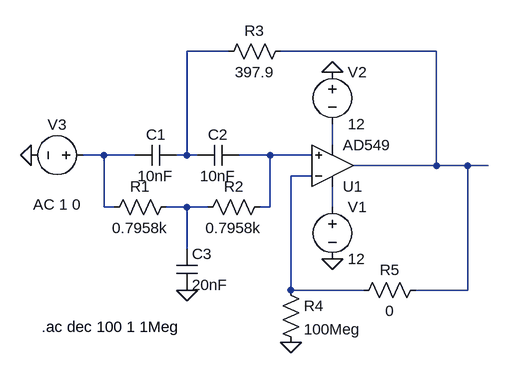
[diagram p0: schematic task5.asc]
task5.asc, the LTspice schematic file:
Version 4.1
SHEET 1 880 680
WIRE 64 0 0 0
WIRE 384 0 144 0
WIRE 224 144 224 112
WIRE -128 160 -160 160
WIRE -80 160 -128 160
WIRE 0 160 0 0
WIRE 0 160 -16 160
WIRE 16 160 0 160
WIRE 128 160 80 160
WIRE 192 160 128 160
WIRE 384 176 384 0
WIRE 384 176 256 176
WIRE 432 176 384 176
WIRE 464 176 432 176
WIRE 192 192 160 192
WIRE -128 240 -128 160
WIRE -112 240 -128 240
WIRE 0 240 -32 240
WIRE 32 240 0 240
WIRE 128 240 128 160
WIRE 128 240 112 240
WIRE 224 240 224 208
WIRE 0 304 0 240
WIRE 160 368 160 192
WIRE 272 368 160 368
WIRE 432 368 432 176
WIRE 432 368 352 368
FLAG 224 32 0
FLAG 224 320 0
FLAG -240 160 0
FLAG 0 368 0
FLAG 160 448 0
SYMBOL voltage 224 224 R0
SYMATTR InstName V1
SYMATTR Value 12
SYMBOL voltage 224 16 R0
SYMATTR InstName V2
SYMATTR Value 12
SYMBOL cap 80 144 R90
WINDOW 0 0 32 VBottom 2
WINDOW 3 32 32 VTop 2
SYMATTR InstName C2
SYMATTR Value 10nF
SYMBOL cap -16 144 R90
WINDOW 0 0 32 VBottom 2
WINDOW 3 32 32 VTop 2
SYMATTR InstName C1
SYMATTR Value 10nF
SYMBOL res 160 -16 R90
WINDOW 0 0 56 VBottom 2
WINDOW 3 32 56 VTop 2
SYMATTR InstName R3
SYMATTR Value 397.9
SYMBOL res 128 224 R90
WINDOW 0 0 56 VBottom 2
WINDOW 3 32 56 VTop 2
SYMATTR InstName R2
SYMATTR Value 0.7958k
SYMBOL res -16 224 R90
WINDOW 0 0 56 VBottom 2
WINDOW 3 32 56 VTop 2
SYMATTR InstName R1
SYMATTR Value 0.7958k
SYMBOL cap -16 304 R0
SYMATTR InstName C3
SYMATTR Value 20nF
SYMBOL OpAmps\\AD549 224 240 M180
SYMATTR InstName U1
SYMBOL res 368 352 R90
WINDOW 0 0 56 VBottom 2
WINDOW 3 32 56 VTop 2
SYMATTR InstName R5
SYMATTR Value 0
SYMBOL res 144 352 R0
SYMATTR InstName R4
SYMATTR Value 100Meg
SYMBOL voltage -144 160 R90
WINDOW 0 -32 56 VBottom 2
WINDOW 3 32 56 VTop 2
WINDOW 123 60 56 VTop 2
WINDOW 39 0 0 Left 0
SYMATTR InstName V3
SYMATTR Value ""
SYMATTR Value2 AC 1 0
TEXT -224 424 Left 2 !.ac dec 100 1 1Meg

The netlist it stands for:
* task5.asc
V1 N008 0 12
V2 0 N003 12
C2 N005 N001 10nF
C1 N001 N004 10nF
R3 N002 N001 397.9
R2 N005 N007 0.7958k
R1 N007 N004 0.7958k
C3 N007 0 20nF
X§U1 N005 N006 N008 N003 N002 AD549  ; pins In+ In- V+ V- OUT
R5 N002 N006 0
R4 N006 0 100Meg
V3 N004 0 AC 1 0
.ac dec 100 1 1Meg
.backanno
.end